# EAGLE schematic CL-400-5-R4 (EAGLE 6.4)
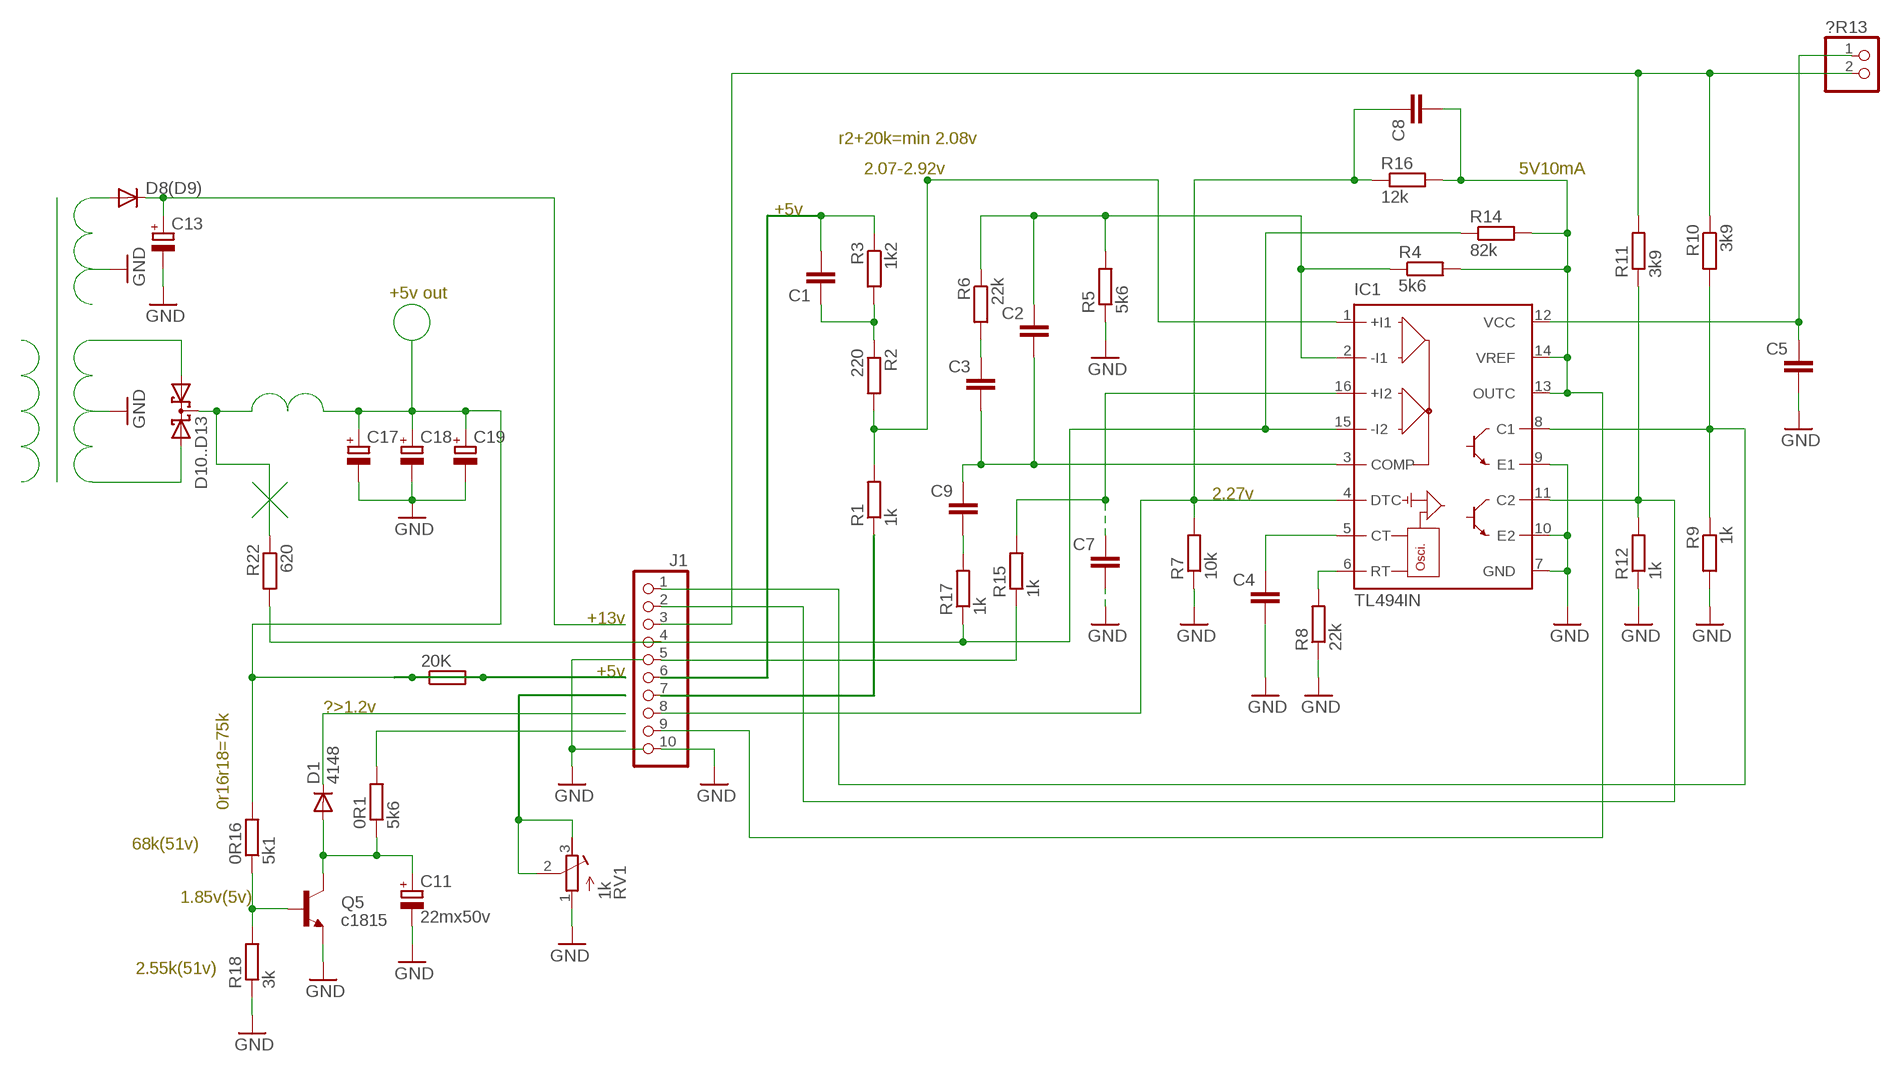
[diagram p0: schematic, sheet 1]

## Parts
0R1  5k6  R-EU_M0805  [M0805]
0R16  5k1  R-EU_M0805  [M0805]
20K  R-EU_M0805  [M0805]
?R13  PINHD-1X2  [1X02]
C1  C-EUC0805  [C0805]
C2  C-EUC0805  [C0805]
C3  C-EUC0805  [C0805]
C4  C-EUC0805  [C0805]
C5  C-EUC0805  [C0805]
C7  C-EUC0805  [C0805]
C8  C-EUC0805  [C0805]
C9  C-EUC0805  [C0805]
C11  22mx50v  CPOL-EUB45181B  [B45181B]
C13  CPOL-EUE7.5-16  [E7,5-16]
C17  CPOL-EUE7.5-16  [E7,5-16]
C18  CPOL-EUE7.5-16  [E7,5-16]
C19  CPOL-EUE7.5-16  [E7,5-16]
D1  4148  1N4148DO35-7  [DO35-7]
D8(D9)  1N4148DO35-7  [DO35-7]
D10..D13  BAS40-05  [SOT23]
IC1  TL494IN  TL494BD  [SO16]
J1  PINHD-1X10/90  [1X10/90]
Q5  c1815  -NPN-TO92-ECB  [TO92-ECB]
R1  1k  R-EU_M0805  [M0805]
R2  220  R-EU_M0805  [M0805]
R3  1k2  R-EU_M0805  [M0805]
R4  5k6  R-EU_M0805  [M0805]
R5  5k6  R-EU_M0805  [M0805]
R6  22k  R-EU_M0805  [M0805]
R7  10k  R-EU_M0805  [M0805]
R8  22k  R-EU_M0805  [M0805]
R9  1k  R-EU_M0805  [M0805]
R10  3k9  R-EU_M0805  [M0805]
R11  3k9  R-EU_M0805  [M0805]
R12  1k  R-EU_M0805  [M0805]
R14  82k  R-EU_M0805  [M0805]
R15  1k  R-EU_M0805  [M0805]
R16  12k  R-EU_M0805  [M0805]
R17  1k  R-EU_M0805  [M0805]
R18  3k  R-EU_M0805  [M0805]
R22  620  R-EU_M0805  [M0805]
RV1  1k  R-TRIMM74X  [RTRIM74X]

## Nets
GND: C4.2 C5.2 C7.2 C11.- C13.- C17.- C18.- C19.- D8(D9).A D10..D13.1(A1) D10..D13.2(A2) IC1.7(GND) IC1.9(E1) IC1.10(E2) J1.10 Q5.E R5.1 R7.1 R8.1 R9.2 R12.1 R18.1 RV1.1(E)
N$1: RV1.2(S) RV1.3(A)
N$2: IC1.8(C1) J1.1 R9.1 R10.2
N$3: J1.7 R1.1
N$4: IC1.11(C2) J1.2 R11.1 R12.2
N$5: ?R13.2 J1.3 R10.1 R11.2
N$6: IC1.15(-I2) J1.4 R14.1 R17.1 R22.2
N$7: C9.2 R17.2
N$8: C2.2 C3.2 C9.1 IC1.3(COMP)
N$9: C3.1 R6.2
N$10: C2.1 IC1.2(-I1) R4.1 R5.2 R6.1
N$11: C8.2 IC1.13(OUTC) IC1.14(VREF) J1.9 R4.2 R14.2 R16.2
N$12: C8.1 IC1.4(DTC) J1.8 R7.2 R16.1
N$13: IC1.1(+I1) R1.2 R2.2
N$14: J1.5 R15.1
N$15: C1.2 J1.6 R3.1
N$16: C1.1 R2.1 R3.2
N$17: C7.1 IC1.16(+I2) R15.2
N$18: ?R13.1 C5.1 IC1.12(VCC)
N$19: IC1.6(RT) R8.2
N$20: C4.1 IC1.5(CT)
N$22: 0R16.1 Q5.B R18.2
N$23: 0R1.1 C11.+ D1.A Q5.C
N$24: 0R1.2
N$25: D1.C
N$26: 0R16.2 20K.1 20K.2 C17.+ C18.+ C19.+ D10..D13.3(C) R22.1
N$29: C13.+ D8(D9).C

## Notes on the sheet
- r2+20k=min 2.08v
- 2.07-2.92v | 5V10mA
- +5v
- +5v out
- 2.27v
- +13v
- +5v
- 0r16r18=75k | ?>1.2v
- 68k(51v)
- 1.85v(5v)
- 2.55k(51v)

## Library data of the parts
0R1 0R16 20K R1-R12 R14-R18 R22 = resistor:R-EU_: RESISTOR, European symbol
?R13 = pinhead:PINHD-1X2: PIN HEADER
C1-C5 C7-C9 = resistor:C-EU: CAPACITOR, European symbol
C11 C13 C17-C19 = rcl:CPOL-EU: POLARIZED CAPACITOR, European symbol
D1 D8(D9) = diode:1N4148: DIODE high speed (Philips)
D10..D13 = diode:BAS40-05: Silicon Schottky Diodes General-purpose diode for high-speed switching
IC1 = linear:TL494*: SWITCHMODE Pulse Width Modulation Control Circuit NCV494B http://onsemi.com tl494-d.pdf
J1 = pinhead:PINHD-1X10: PIN HEADER
Q5 = transistor:*-NPN-: NPN Transistror BF959 corrected 2008.03.06
RV1 = resistor:R-TRIMM: Trimm resistor